# EAGLE design working (EAGLE 9.6.2)
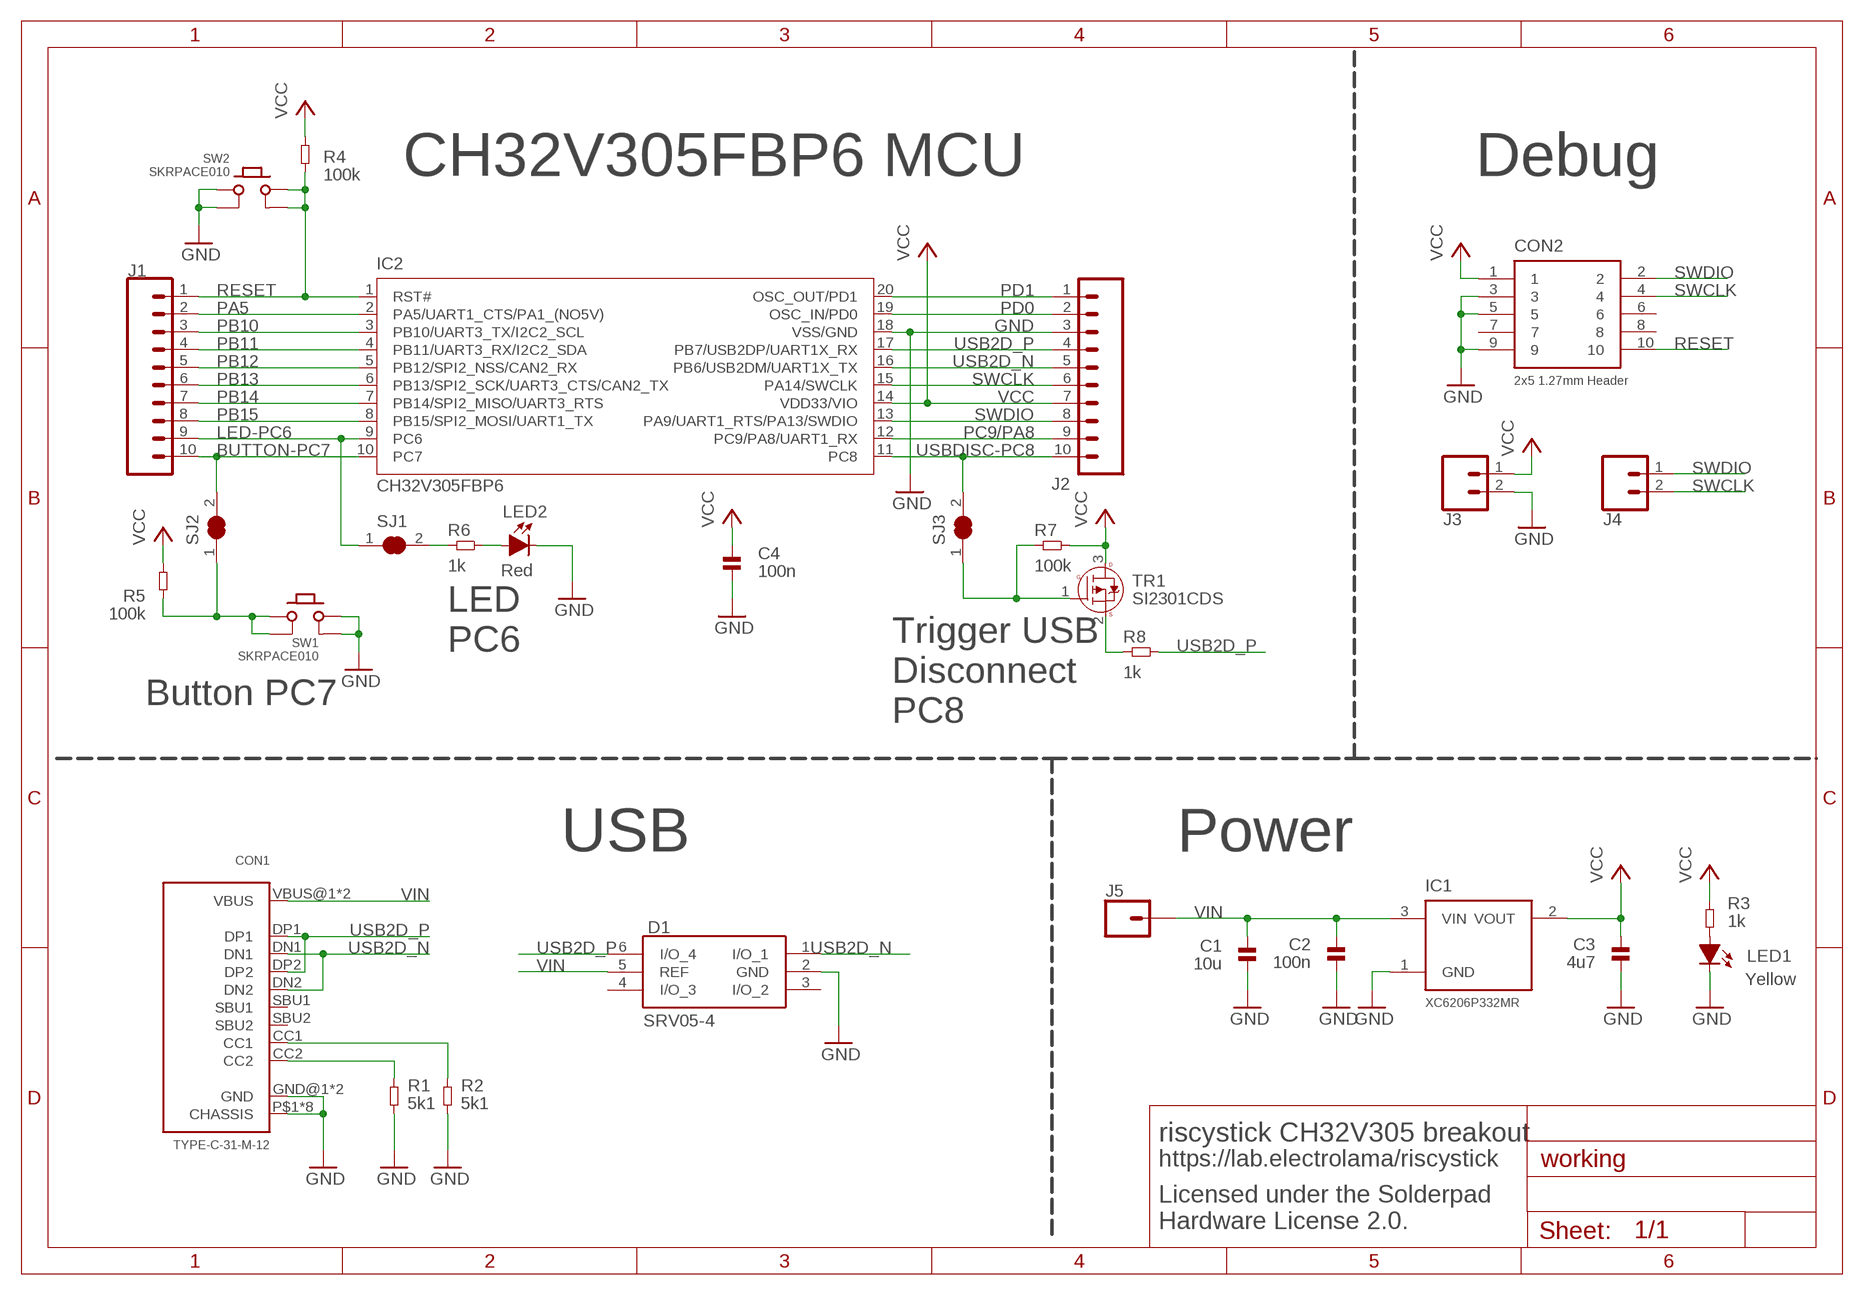
[diagram p0: schematic, sheet 1]

## Parts
C1  10u  CAP-0603  [_PKG_C_0603]
C2  100n  CAP-0402  [_PKG_C_0402]
C3  4u7  CAP-0402  [_PKG_C_0402]
C4  100n  CAP-0402  [_PKG_C_0402]
CON1  TYPE-C-31-M-12  USBC_USB-C-12  [USBC_C-31-M-12]
CON2  2x5 1.27mm Header  CON_1.27MM_SMD_2X5_NOSHROUD  [PZ127VS-12-10-H10-A38]
D1  SRV05-4  DIODE-TVS-SRV05-4  [SOT95P280X145-6N]
IC1  XC6206P332MR  POWER-LDO-XC6206PMR  [SOT96P237X111-3N]
IC2  CH32V305FBP6  MCU-CH32V305F  [TSSOP20-WCH]
J1  CONN_10LOCK  [1X10_LOCK]
J2  CONN_10LOCK  [1X10_LOCK]
J3  CONN_02LOCK  [1X02_LOCK]
J4  CONN_02LOCK  [1X02_LOCK]
J5  CONN_01  [1X01]
LED1  Yellow  LED-0805  [_PKG_LED_0805]
LED2  Red  LED-0805  [_PKG_LED_0805]
R1  5k1  RES-0402  [_PKG_R_0402]
R2  5k1  RES-0402  [_PKG_R_0402]
R3  1k  RES-0402  [_PKG_R_0402]
R4  100k  RES-0402  [_PKG_R_0402]
R5  100k  RES-0402  [_PKG_R_0402]
R6  1k  RES-0402  [_PKG_R_0402]
R7  100k  RES-0402  [_PKG_R_0402]
R8  1k  RES-0402  [_PKG_R_0402]
SJ1  SJ-SHORT  [SJ-SHORT]
SJ2  SJ-SHORT  [SJ-SHORT]
SJ3  SJ-SHORT  [SJ-SHORT]
SW1  SKRPACE010  PUSHBUTTON-4.2X3.2MM  [PUSHBUTTON-4.2X3.2MM]
SW2  SKRPACE010  PUSHBUTTON-4.2X3.2MM  [PUSHBUTTON-4.2X3.2MM]
TR1  SI2301CDS  MOSFET-P-SI2301CDS  [SOT96P237X111-3N]

## Nets
BUTTON-PC7: IC2.10(PC7) J1.10 SJ2.2
GND: C1.2 C2.2 C3.2 C4.2 CON1.GND@1(GND) CON1.GND@2(GND) CON1.P$1(CHASSIS) CON1.P$2(CHASSIS) CON1.P$3(CHASSIS) CON1.P$4(CHASSIS) CON1.P$5(CHASSIS) CON1.P$6(CHASSIS) CON1.P$7(CHASSIS) CON1.P$8(CHASSIS) CON2.3 CON2.5 CON2.9 D1.2(GND) IC1.1(GND) IC2.18(VSS/GND) J2.3 J3.2 LED1.C LED2.C R1.1 R2.1 SW1.3(2_1) SW1.4(2_2) SW2.1(1_1) SW2.2(1_2)
LED-PC6: IC2.9(PC6) J1.9 SJ1.1
N$1: R5.2 SJ2.1 SW1.1(1_1) SW1.2(1_2)
N$9: CON1.CC1 R2.2
N$10: CON1.CC2 R1.2
N$11: R8.2 TR1.2(S)
N$13: LED1.A R3.1
N$14: LED2.A R6.1
N$21: R6.2 SJ1.2
N$99: R7.2 SJ3.1 TR1.1(G)
PA5: IC2.2(PA5/UART1_CTS/PA1_(NO5V)) J1.2
PB10: IC2.3(PB10/UART3_TX/I2C2_SCL) J1.3
PB11: IC2.4(PB11/UART3_RX/I2C2_SDA) J1.4
PB12: IC2.5(PB12/SPI2_NSS/CAN2_RX) J1.5
PB13: IC2.6(PB13/SPI2_SCK/UART3_CTS/CAN2_TX) J1.6
PB14: IC2.7(PB14/SPI2_MISO/UART3_RTS) J1.7
PB15: IC2.8(PB15/SPI2_MOSI/UART1_TX) J1.8
PC9/PA8: IC2.12(PC9/PA8/UART1_RX) J2.9
PD0: IC2.19(OSC_IN/PD0) J2.2
PD1: IC2.20(OSC_OUT/PD1) J2.1
RESET: CON2.10 IC2.1(RST#) J1.1 R4.2 SW2.3(2_1) SW2.4(2_2)
SWCLK: CON2.4 IC2.15(PA14/SWCLK) J2.6 J4.2
SWDIO: CON2.2 IC2.13(PA9/UART1_RTS/PA13/SWDIO) J2.8 J4.1
USB2D_N: CON1.DN1 CON1.DN2 D1.1(I/O_1) IC2.16(PB6/USB2DM/UART1X_TX) J2.5
USB2D_P: CON1.DP1 CON1.DP2 D1.6(I/O_4) IC2.17(PB7/USB2DP/UART1X_RX) J2.4 R8.1
USBDISC-PC8: IC2.11(PC8) J2.10 SJ3.2
VCC: C3.1 C4.1 CON2.1 IC1.2(VOUT) IC2.14(VDD33/VIO) J2.7 J3.1 R3.2 R4.1 R5.1 R7.1 TR1.3(D)
VIN: C1.1 C2.1 CON1.VBUS@1(VBUS) CON1.VBUS@2(VBUS) D1.5(REF) IC1.3(VIN) J5.1
Unconnected: CON1.SBU1 CON1.SBU2 CON2.6 CON2.7 CON2.8 D1.3(I/O_2) D1.4(I/O_3)

## Notes on the sheet
- CH32V305FBP6 MCU | Debug
- LED
  PC6
- Button PC7
- Trigger USB
  Disconnect
  PC8
- USB | Power
- riscystick CH32V305 breakout
- https://lab.electrolama/riscystick
- Licensed under the Solderpad
  Hardware License 2.0.

## Library data of the parts
C1 = ok-discretes-dev:CAP; JLCASSY: C96446
C2 C4 = ok-discretes-dev:CAP; JLCASSY: C1525
C3 = ok-discretes-dev:CAP; JLCASSY: C23733
CON1 = ok-connectors-dev:USBC_USB-C-12; JLCASSY: C165948
CON2 = ok-connectors-dev:CON_1.27MM_SMD_2X5_NOSHROUD; JLCASSY: C2935458
D1 = ok-discretes-dev:DIODE-TVS-SRV05-4: SRV05 Series 4 Ch 3.5 pF 15 Vclamp Steering Diode/TVS Array Combo - SOT-23-6 Source: Datasheet <https://datasheet.lcsc.com/szlcsc/1809192313_ProTek-Devices-SRV05-4-P-T7_C85364.pdf>; DESCRIPTION: SRV05 Series 4 Ch 3.5 pF 15 Vclamp Steering Diode/TVS Array Combo - SOT-23-6; HEIGHT: 1.45mm; JLCASSY: C558453; MANUFACTURER_NAME: ProTek Devices; MANUFACTURER_PART_NUMBER: SRV05-4-P-T7
IC1 = ok-chips-dev:POWER-LDO-XC6206P???MR; JLCASSY: C5446
IC2 = ok-chips-dev:MCU-CH32V305F
J1 J2 = SparkFun-Connectors:CONN_10: Multi connection point. Often used as Generic Header-pin footprint for 0.1 inch spaced/style header connections On any of the 0.1 inch spaced packages, you can populate with these: Break Away Headers - Straight <https://www.sparkfun.com/products/116> (PRT-00116) Break Away Male Headers - Right Angle <https://www.sparkfun.com/products/553> (PRT-00553) Female Headers <https://www.sparkfun.com/products/115> (PRT-00115) Break Away Headers - Machine Pin <https://www.sparkfun.com/products/117> (PRT-00117) Break Away Female Headers - Swiss Machine Pin <https://www.sparkfun.com/products/743> (PRT-00743) Arduino Stackable Header - 10 Pin <https://www.sparkfun.com/products/11376> (PRT-11376) For SCREWTERMINALS and SPRING TERMINALS visit here: Screw Terimnals on SparkFun.com <https://www.sparkfun.com/search/results?term=Screw+Terminals> (5mm/3.5mm/2.54mm spacing) This device is also useful as a general connection point to wire up your design to another part of your project. Our various solder wires solder well into these plated through hole pads. Hook-Up Wire - Assortment (Stranded, 22 AWG) <https://www.sparkfun.com/products/11375> (PRT-11375) Hook-Up Wire - Assortment (Solid Core, 22 AWG) <https://www.sparkfun.com/products/11367> (PRT-11367) View the entire wire category on our website here <https://www.sparkfun.com/categories/141> Special notes: Molex polarized connector foot print use with SKU : PRT-08231 with associated crimp pins and housings. 1MM SMD Version SKU: PRT-10208 NOTES ON THE VARIANTS LOCK and LOCK_LONGPADS... This footprint was designed to help hold the alignment of a through-hole component (i.e. 6-pin header) while soldering it into place. You may notice that each hole has been shifted either up or down by 0.005 of an inch from it's more standard position (which is a perfectly straight line). This slight alteration caused the pins (the squares in the middle) to touch the edges of the holes. Because they are alternating, it causes a "brace" to hold the component in place. 0.005 has proven to be the perfect amount of "off-center" position when using our standard breakaway headers. Although looks a little odd when you look at the bare footprint, once you have a header in there, the alteration is very hard to notice. Also,if you push a header all the way into place, it is covered up entirely on the bottom side.
J3 J4 = SparkFun-Connectors:CONN_02: Multi connection point. Often used as Generic Header-pin footprint for 0.1 inch spaced/style header connections On any of the 0.1 inch spaced packages, you can populate with these: Break Away Headers - Straight <https://www.sparkfun.com/products/116> (PRT-00116) Break Away Male Headers - Right Angle <https://www.sparkfun.com/products/553> (PRT-00553) Female Headers <https://www.sparkfun.com/products/115> (PRT-00115) Break Away Headers - Machine Pin <https://www.sparkfun.com/products/117> (PRT-00117) Break Away Female Headers - Swiss Machine Pin <https://www.sparkfun.com/products/743> (PRT-00743) For SCREWTERMINALS and SPRING TERMINALS visit here: Screw Terimnals on SparkFun.com <https://www.sparkfun.com/search/results?term=Screw+Terminals> (5mm/3.5mm/2.54mm spacing) This device is also useful as a general connection point to wire up your design to another part of your project. Our various solder wires solder well into these plated through hole pads. Hook-Up Wire - Assortment (Stranded, 22 AWG) <https://www.sparkfun.com/products/11375> (PRT-11375) Hook-Up Wire - Assortment (Solid Core, 22 AWG) <https://www.sparkfun.com/products/11367> (PRT-11367) View the entire wire category on our website here <https://www.sparkfun.com/categories/141> Special notes: Molex polarized connector foot print use with: PRT-08233 with associated crimp pins and housings. 2.54_SCREWTERM for use with PRT-10571. 3.5mm Screw Terminal footprints for PRT-08084 5mm Screw Terminal footprints for use with PRT-08432
J5 = SparkFun-Connectors:CONN_01: Single connection point. Often used as Generic Header-pin footprint for 0.1 inch spaced/style header connections On any of the 0.1 inch spaced packages, you can populate with these: Break Away Headers - Straight <https://www.sparkfun.com/products/116> (PRT-00116) Break Away Male Headers - Right Angle <https://www.sparkfun.com/products/553> (PRT-00553) Female Headers <https://www.sparkfun.com/products/115> (PRT-00115) Break Away Headers - Machine Pin <https://www.sparkfun.com/products/117> (PRT-00117) Break Away Female Headers - Swiss Machine Pin <https://www.sparkfun.com/products/743> (PRT-00743) This device is also useful as a general connection point to wire up your design to another part of your project. Our various solder wires solder well into these plated through hole pads. Hook-Up Wire - Assortment (Stranded, 22 AWG) <https://www.sparkfun.com/products/11375> (PRT-11375) Hook-Up Wire - Assortment (Solid Core, 22 AWG) <https://www.sparkfun.com/products/11367> (PRT-11367) View the entire wire category on our website here <https://www.sparkfun.com/categories/141> Special notes: SMTSO-256-ET is a "flush mount" nut for a 4-40 screw. We mostly use this on specialty testbeds; it is a nice way to connect hardware to your PCB at an adjustable hieght. Also note, the SNAP packages are for using a snappable style connector. We sell a baggie of snaps and they are also used on two LilyPad designs: Snap Assortment - 30 pack (male and female) <https://www.sparkfun.com/products/11347> (DEV-11347) LilyPad Arduino SimpleSnap <https://www.sparkfun.com/products/10941> (DEV-10941) LilyPad SimpleSnap Protoboard <https://www.sparkfun.com/products/10940> (DEV-10940)
LED1 = ok-opto-dev:LED; JLCASSY: C2296
LED2 = ok-opto-dev:LED; JLCASSY: C84256
R1 R2 = ok-discretes-dev:RES; JLCASSY: C25905
R3 R6 R8 = ok-discretes-dev:RES; JLCASSY: C11702
R4 R5 R7 = ok-discretes-dev:RES; JLCASSY: C25741
SJ1-SJ3 = ok-mechanical-dev:SJ-SHORT
SW1 SW2 = ok-electromech-dev:PUSHBUTTON-4.2X3.2MM; JLCASSY: C139797
TR1 = ok-discretes-dev:MOSFET-P-SI2301CDS; JLCASSY: C10487

## Board
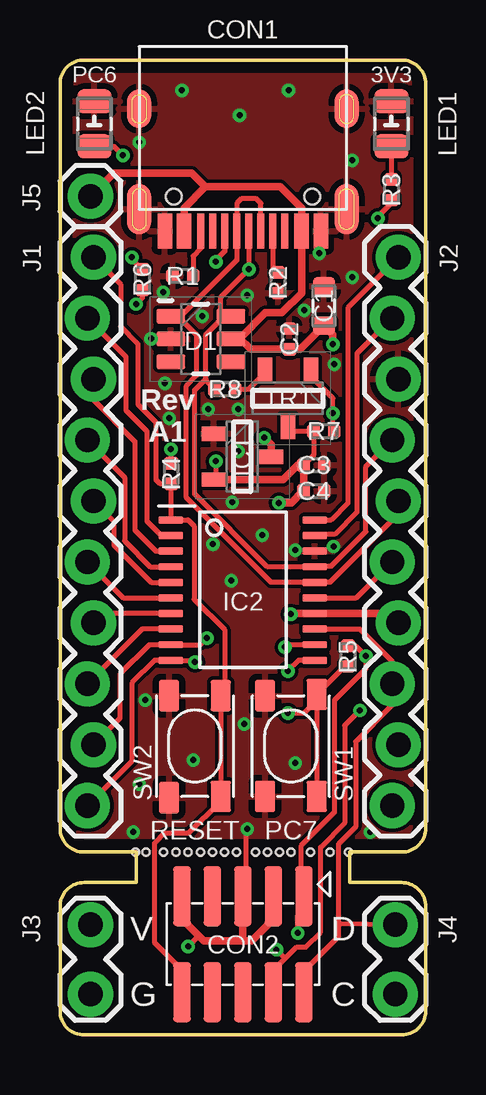
[diagram p1: board, top side]
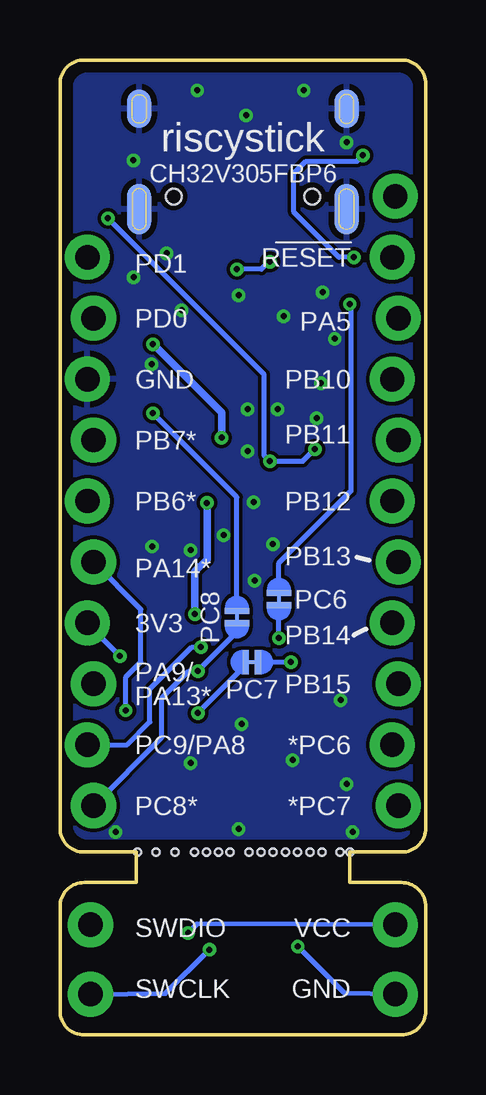
[diagram p2: board, bottom side, seen from below]

Size 15.24 x 40.64 mm. Coordinates in mm from the lower left corner, seen from the top.
Outline: 3.17,6.35 1,6.35 arc90 0,5.35 0,1 arc90 1,0 14.24,0 arc90 15.24,1 15.24,5.35 arc90 14.24,6.35 12.07,6.35 12.07,7.62 14.24,7.62 arc90 15.24,8.62 15.24,39.64 arc90 14.24,40.64 1,40.64 arc90 0,39.64 0,8.62 arc90 1,7.62 3.17,7.62 3.17,6.35
Copper layers (1*16): Top 0.035mm / dielectric 1.5mm / Bottom 0.035mm
Design rules "dirt_cheap_dirty_boards.v1.1": minimum track width 6mil, minimum drill 12mil, track to track 6mil, track to pad 6mil, pad to pad 6mil, via to via 6mil, smd to smd 0mil, copper to edge 10mil, drill to drill 10mil, minimum pad ring 10mil, minimum via ring 6mil, stop-mask expansion 2mil, vias tented up to drill 25mil, thermal gap 10mil
Holes 0.3 mm at 4.32,7.62 4.83,7.62 5.34,7.62 5.85,7.62 6.36,7.62 8.15,7.62 8.64,7.62 9.63,7.62 10.44,7.62 3.15,7.62 12.02,7.62 3.58,7.62 6.86,7.62 7.36,7.62 9.14,7.62 11.24,7.62

### Footprints (pad centres in the part's own frame; a part is rotated, then mirrored left to right if it is on the bottom)
_PKG_C_0603 = smd 0.79 x 0.93: 1 -0.82,0; 2 0.82,0
_PKG_C_0402 = smd 0.54 x 0.6: 1 -0.43,0; 2 0.43,0
USBC_C-31-M-12 = smd 0.3 x 1.45: CC1 -1.25,3.005; CC2 1.75,3.005; DN1 0.25,3.005; DN2 -0.75,3.005; DP1 -0.25,3.005; DP2 0.75,3.005; SBU1 1.25,3.005; SBU2 -1.75,3.005 | smd 0.6 x 1.45: GND@1 -3.25,3.005; GND@2 3.25,3.005; VBUS@1 -2.45,3.005; VBUS@2 2.45,3.005 | smd 1 x 2.1: P$1 4.32,2.09; P$2 -4.32,2.09 | smd 1 x 1.6: P$3 -4.32,-2.09; P$4 4.32,-2.09 | smd 1 x 2.1 bottom: P$5 -4.32,2.09; P$8 4.32,2.09 | smd 1 x 1.6 bottom: P$6 -4.32,-2.09; P$7 4.32,-2.09 | hole 0.65: 2.89,1.56; -2.89,1.56
PZ127VS-12-10-H10-A38 = smd 0.74 x 2.5: 1 2.54,2; 2 2.54,-2; 3 1.27,2; 4 1.27,-2; 5 0,2; 6 0,-2; 7 -1.27,2; 8 -1.27,-2; 9 -2.54,2; 10 -2.54,-2
SOT95P280X145-6N = smd 1.2 x 0.6: 1 -1.25,0.95; 2 -1.25,0; 3 -1.25,-0.95; 4 1.25,-0.95; 5 1.25,0; 6 1.25,0.95
SOT96P237X111-3N = smd 1 x 0.6: 1 -1.2,0.955; 2 -1.2,-0.955; 3 1.2,0
TSSOP20-WCH = smd 0.305 x 1.016: 1 -2.925,-2.997; 2 -2.275,-2.997; 3 -1.625,-2.997; 4 -0.975,-2.997; 5 -0.325,-2.997; 6 0.325,-2.997; 7 0.975,-2.997; 8 1.625,-2.997; 9 2.275,-2.997; 10 2.925,-2.997; 11 2.925,2.997; 12 2.275,2.997; 13 1.625,2.997; 14 0.975,2.997; 15 0.325,2.997; 16 -0.325,2.997; 17 -0.975,2.997; 18 -1.625,2.997; 19 -2.275,2.997; 20 -2.925,2.997
1X10_LOCK = drill 1.016 pad 1.88: 1 0,0.127; 2 2.54,-0.127; 3 5.08,0.127; 4 7.62,-0.127; 5 10.16,0.127; 6 12.7,-0.127; 7 15.24,0.127; 8 17.78,-0.127; 9 20.32,0.127; 10 22.86,-0.127
1X02_LOCK = drill 1.016 pad 1.88: 1 -0.178,0; 2 2.718,0
1X01 = drill 1.016 pad 1.88: 1 0,0
_PKG_LED_0805 = smd 1 x 1.42: A 0.935,0; C -0.935,0
_PKG_R_0402 = smd 0.54 x 0.6: 1 -0.43,0; 2 0.43,0
SJ-SHORT = smd 0.254 x 1.016: 1 -0.254,0; 2 0.254,0 | smd 0.508 x 0.152: S 0,0
PUSHBUTTON-4.2X3.2MM = smd 1.3 x 0.85: 1 -2.15,1.075; 2 2.1,1.075; 3 -2.1,-1.075; 4 2.1,-1.075

### Placement (x,y rotation side)
C1  11,30.38 90 top
C2  9.56,29.01 90 top
C3  10.58,23.75 0 top
C4  10.58,22.67 0 top
CON1  7.62,36.51 180 top
CON2  7.62,3.78 0 top
D1  5.87,29.01 0 top
IC1  7.6,24.1 0 top
IC2  7.62,18.54 270 top
J1  1.27,32.41 270 top
J2  13.97,32.41 270 top
J3  1.27,4.41 270 top
J4  13.97,4.41 270 top
J5  1.27,34.95 0 top
LED1  13.81,37.98 270 top
LED2  1.43,37.98 270 top
R1  5.12,31.63 0 top
R2  9.09,31.35 90 top
R3  13.81,35.23 270 top
R4  4.64,23.4 270 top
R5  12,15.79 270 top
R6  3.43,31.48 270 top
R7  11,25.16 0 top
R8  6.87,26.91 0 top
SJ1  6.12,18.16 90 bottom
SJ2  7.25,15.54 0 bottom
SJ3  7.87,17.41 270 bottom
SW1  9.62,12.04 270 top
SW2  5.62,12.04 90 top
TR1  9.5,26.54 270 top

### Tracks (layer width: path | path; a pad name or v marks a point on that pad's centre or on a via)
BUTTON-PC7  (via drill 0.25)
  Top 0.2: v5.62,15.54 5.54,15.61 IC2.10 3.95,15.61 3,14.66 3,11.41 J1.10
  Bottom 0.2: SJ2.2 v5.62,15.54
GND  (via drill 0.25)
  Top 0.2: 7.75,8.54 7.75,5.9 | D1.2 v3.8,29.01 v3.79,29.02 | v5.33,3.68 5.72,4.07 5.72,4.19
  Top 0.305: CON2.9 5.08,4.83 5.72,4.19 6,3.91 7.62,3.91 | 7.62,3.91 8,3.91 8.89,4.81 CON2.3 | 7.62,3.91 CON2.5 7.75,5.9
  Bottom 0.2: J3.2 3.38,1.73 v5.33,3.68
  other vias: 3.3,37.2 5.08,39.37 7.49,38.33 9.53,39.37 12.18,36.45 5.92,29.95 4.3,30.95 12.18,31.58 10.8,32.58 7.8,30.83 10.18,30.2 11.43,27.95 7.42,24.33 7.42,26.08 6.17,26.08 4.55,25.7 7.17,22.2 11.4,20.36 9.8,20.2 9.8,11.33 5.55,11.45 3.3,10.45 7.67,12.95 7.8,8.58 12.93,8.46 3.05,8.46 3.55,13.95 8.43,20.83 6.37,20.46 7.13,18.93 4.37,27.16
  pour Top: 14.11,8.25 1.13,8.25 arc-90 0.63,8.75 0.63,39.5 arc-90 1.13,40 14.11,40 arc-90 14.61,39.5 14.61,8.75 arc-90
  pour Bottom: 14.11,8.25 1.13,8.25 arc-90 0.63,8.75 0.63,39.5 arc-90 1.13,40 14.11,40 arc-90 14.61,39.5 14.61,8.75 arc-90
LED-PC6  (via drill 0.25)
  Top 0.2: v6.12,16.54 5.85,16.27 IC2.9 3.72,16.27 2.5,15.04 2.5,13.19 J1.9
  Bottom 0.2: v6.12,16.54 SJ1.1
N$1  (via drill 0.25)
  Top 0.2: v9.5,13.41 10.17,13.41 10.7,13.94 SW1.1 | SW1.1 11.87,15.36 R5.2 | SW1.1 SW1.2
  Bottom 0.2: v9.5,13.41 v9.5,13.42 7.5,15.41 SJ2.1
N$9
  Top 0.2: CON1.CC1 8.87,32 R2.2
N$10
  Top 0.2: CON1.CC2 5.87,32.79 5.55,32.47 R1.2
N$11
  Top 0.2: R8.2 7.87,26.91 8.54,27.59 TR1.2
N$13
  Top 0.2: LED1.A R3.1
N$14  (via drill 0.25)
  Top 0.2: R6.1 3,32.34 v3,32.41 | LED2.A 2.24,37.04 v2.62,36.66
  Bottom 0.2: v3,32.41 3.62,32.41 5.5,34.29 5.5,35.91 5,36.41 2.87,36.41 v2.62,36.66
N$21  (via drill 0.25)
  Top 0.2: R6.2 3.43,30.73 v3.17,30.46
  Bottom 0.2: SJ1.2 6.12,19.66 3.12,22.66 3.12,30.41 v3.17,30.46
N$99  (via drill 0.25)
  Top 0.2: TR1.1 10.45,27.46 11.37,26.54 v11.37,25.91 11.37,25.22 R7.2
  Bottom 0.2: v11.37,25.91 7.87,22.41 SJ3.1
PA5
  Top 0.2: J1.2 2.75,28.27 2.75,26.04 3.62,25.16 3.62,21.41 4.22,20.81 IC2.2
PB10
  Top 0.2: J1.3 1.4,26.46 3.12,24.74 3.12,21.04 4,20.16 IC2.3
PB11
  Top 0.2: J1.4 2.69,23.24 2.69,20.59 3.77,19.52 IC2.4
PB12
  Top 0.2: J1.5 2.25,21.41 2.25,20.41 3.79,18.86 IC2.5
PB13
  Top 0.2: J1.6 2.64,18.21 IC2.6
PB14
  Top 0.2: IC2.7 1.79,17.56 J1.7
PB15
  Top 0.2: IC2.8 3.42,16.91 J1.8
PC9/PA8  (via drill 0.25)
  Top 0.2: IC2.12 9.47,16.27 v9.37,16.16
  Bottom 0.2: J2.9 12.44,12.09 11.5,13.04 11.5,14.41 9.75,16.16 v9.37,16.16
PD0
  Top 0.2: J2.2 12.37,28.4 12.37,21.79 11.45,20.87 10.67,20.87 IC2.19
PD1
  Top 0.2: J2.1 12,30.31 12,22.16 11.29,21.46 IC2.20
RESET
  Top 0.2: CON2.10 5.08,2.7 3.95,3.84 3.95,7.99 4.37,8.41 5.37,8.41 6.7,9.74 SW2.3 SW2.4 6.86,14.3 6.86,16.89 5.59,18.16 5.59,21.21 5.33,21.46 IC2.1 4.62,22.96 R4.2 4.18,22.97 4,23.16 4,25.54 3.25,26.29 3.25,28.82 2.52,29.54 2.52,31.29 J1.1
SWCLK  (via drill 0.25)
  Top 0.2: CON2.4 8.89,2.68 9.33,3.12 | 9.33,3.12 9.87,3.66 10.25,3.66 10.86,4.28 10.86,7.82 11.86,8.83 11.86,12.89 v12.5,13.53 | IC2.15 12.34,18.21 J2.6 | v9.02,3.56 9.33,3.25 9.33,3.12
  Bottom 0.2: v12.5,13.53 12.5,14.91 11.87,15.54 11.87,17.74 J2.6 | J4.2 10.85,1.73 v9.02,3.56
SWDIO
  Top 0.2: CON2.2 10.16,2.65 11.61,4.1 11.61,4.7 | 11.61,4.7 11.61,7.96 12.32,8.67 12.32,12.22 13.84,13.75 J2.8 13.84,15.57 12.5,16.91 IC2.13 | J4.1 11.69,4.62 11.61,4.7
USB2D_N
  Top 0.2: CON1.DN2 8.37,34.66 8.18,34.85 7.56,34.85 7.37,34.66 CON1.DN1 7.37,32.29 5.04,29.96 D1.1 4.91,29.96 5.71,29.16 5.71,27.5 5.26,27.05 5.26,22.4 8.8,18.86 IC2.16 11.25,18.86 14.1,21.72 J2.5
USB2D_P  (via drill 0.25)
  Top 0.2: 6.84,29.96 6.79,29.96 6.68,30.07 6.68,30.73 v7.87,31.91 CON1.DP1 | CON1.DP2 6.87,32.66 6.5,32.29 v6.5,32.23 | 6.08,27.35 6.08,29.19 6.84,29.96 | 6.08,27.35 6.08,27.28 R8.1 | 6.08,27.35 5.61,26.89 5.61,22.55 8.64,19.52 IC2.17 10.64,19.54 11.31,19.54 12.75,20.97 12.75,23.7 J2.4 | 6.84,29.96 D1.6
  Bottom 0.2: v7.87,31.91 6.85,31.91 6.54,32.23 v6.5,32.23
USBDISC-PC8  (via drill 0.25)
  Top 0.2: IC2.11 9.95,15.61 v9.5,15.16
  Bottom 0.2: J2.10 11,12.4 11,14.04 9.87,15.16 v9.5,15.16 7.87,16.79 SJ3.2
VCC  (via drill 0.25)
  Top 0.2: R5.1 12.32,16.22 v12.75,15.79 12.75,15.26 11.43,13.95 11.43,9.27 10.03,7.87 10.03,5.91 CON2.1 10.16,5.21 9.91,4.95 v9.91,4.24 | R4.1 4.63,24.4 v4.62,24.41 | TR1.3 9.67,25.16 R7.1 10.56,24.16 C3.1 | R3.2 13.81,34.67 13.25,34.11 v13.25,34.04 | v6.5,23.91 6.5,23.25 IC1.2
  Top 0.305: J2.7 13.71,17.56 IC2.14 9.64,17.56 v9.62,17.54 | v9.12,22.18 9.63,22.18 10.12,22.67 C4.1 C3.1 9.91,23.75 9.31,23.15 IC1.2
  Bottom 0.2: J2.7 14.1,17.14 v12.75,15.79 | J3.1 9.53,4.62 v9.91,4.24 | v13.25,34.04 6.75,27.54 6.75,24.16 v6.5,23.91 5.12,23.91 v4.62,24.41
  Bottom 0.305: v9.12,22.18 v9.11,22.17 9.11,19.83 9.62,19.32 v9.62,17.54
VIN  (via drill 0.25)
  Top 0.305: D1.5 7.17,29.06 7.48,29.06 | 7.48,29.06 7.51,29.06 8.56,30.1 9.25,30.1 10.07,30.93 CON1.VBUS@1 10.07,34.47 9.18,35.35 6.06,35.35 | 7.48,29.06 7.96,28.58 C2.1 10.01,28.58 C1.1 11.37,29.19 v11.37,28.79 | CON1.VBUS@2 5.17,34.47 6.06,35.35 | IC1.3 8.8,24.61 v8.52,24.89 v8.51,24.89 | J5.1 2.23,35.91 5.5,35.91 6.06,35.35
  Bottom 0.305: v8.51,24.89 8.51,25.95 11.35,28.79 v11.37,28.79

### Text on the board
tPlace: PC6 | 3V3 | Rev / A1 | RESET | PC7 | V | D | G | C
bPlace: riscystick | CH32V305FBP6 | RESET | PD1 | PA5 | PD0 | PB10 | GND | PB11 | PB7* | PB12 | PB6* | PB13 | PA14* | PC6 | PC8 | 3V3 | PB14 | PA9/ | PB15 | PC7 | PA13* | *PC6 | PC9/PA8 | *PC7 | PC8* | VCC | SWDIO | GND | SWCLK